# Altium schematic sheet BOC_Boot.SchDoc: Board-On-Chip Bootup Circuits
size B; Organization: Altium Limited; Address1: L3, 12a Rodborough Rd; Address2: Frenchs Forest; Address3: NSW; Address4: Australia 2086; Revision: 1.06; SheetNumber: 2; SheetTotal: 16
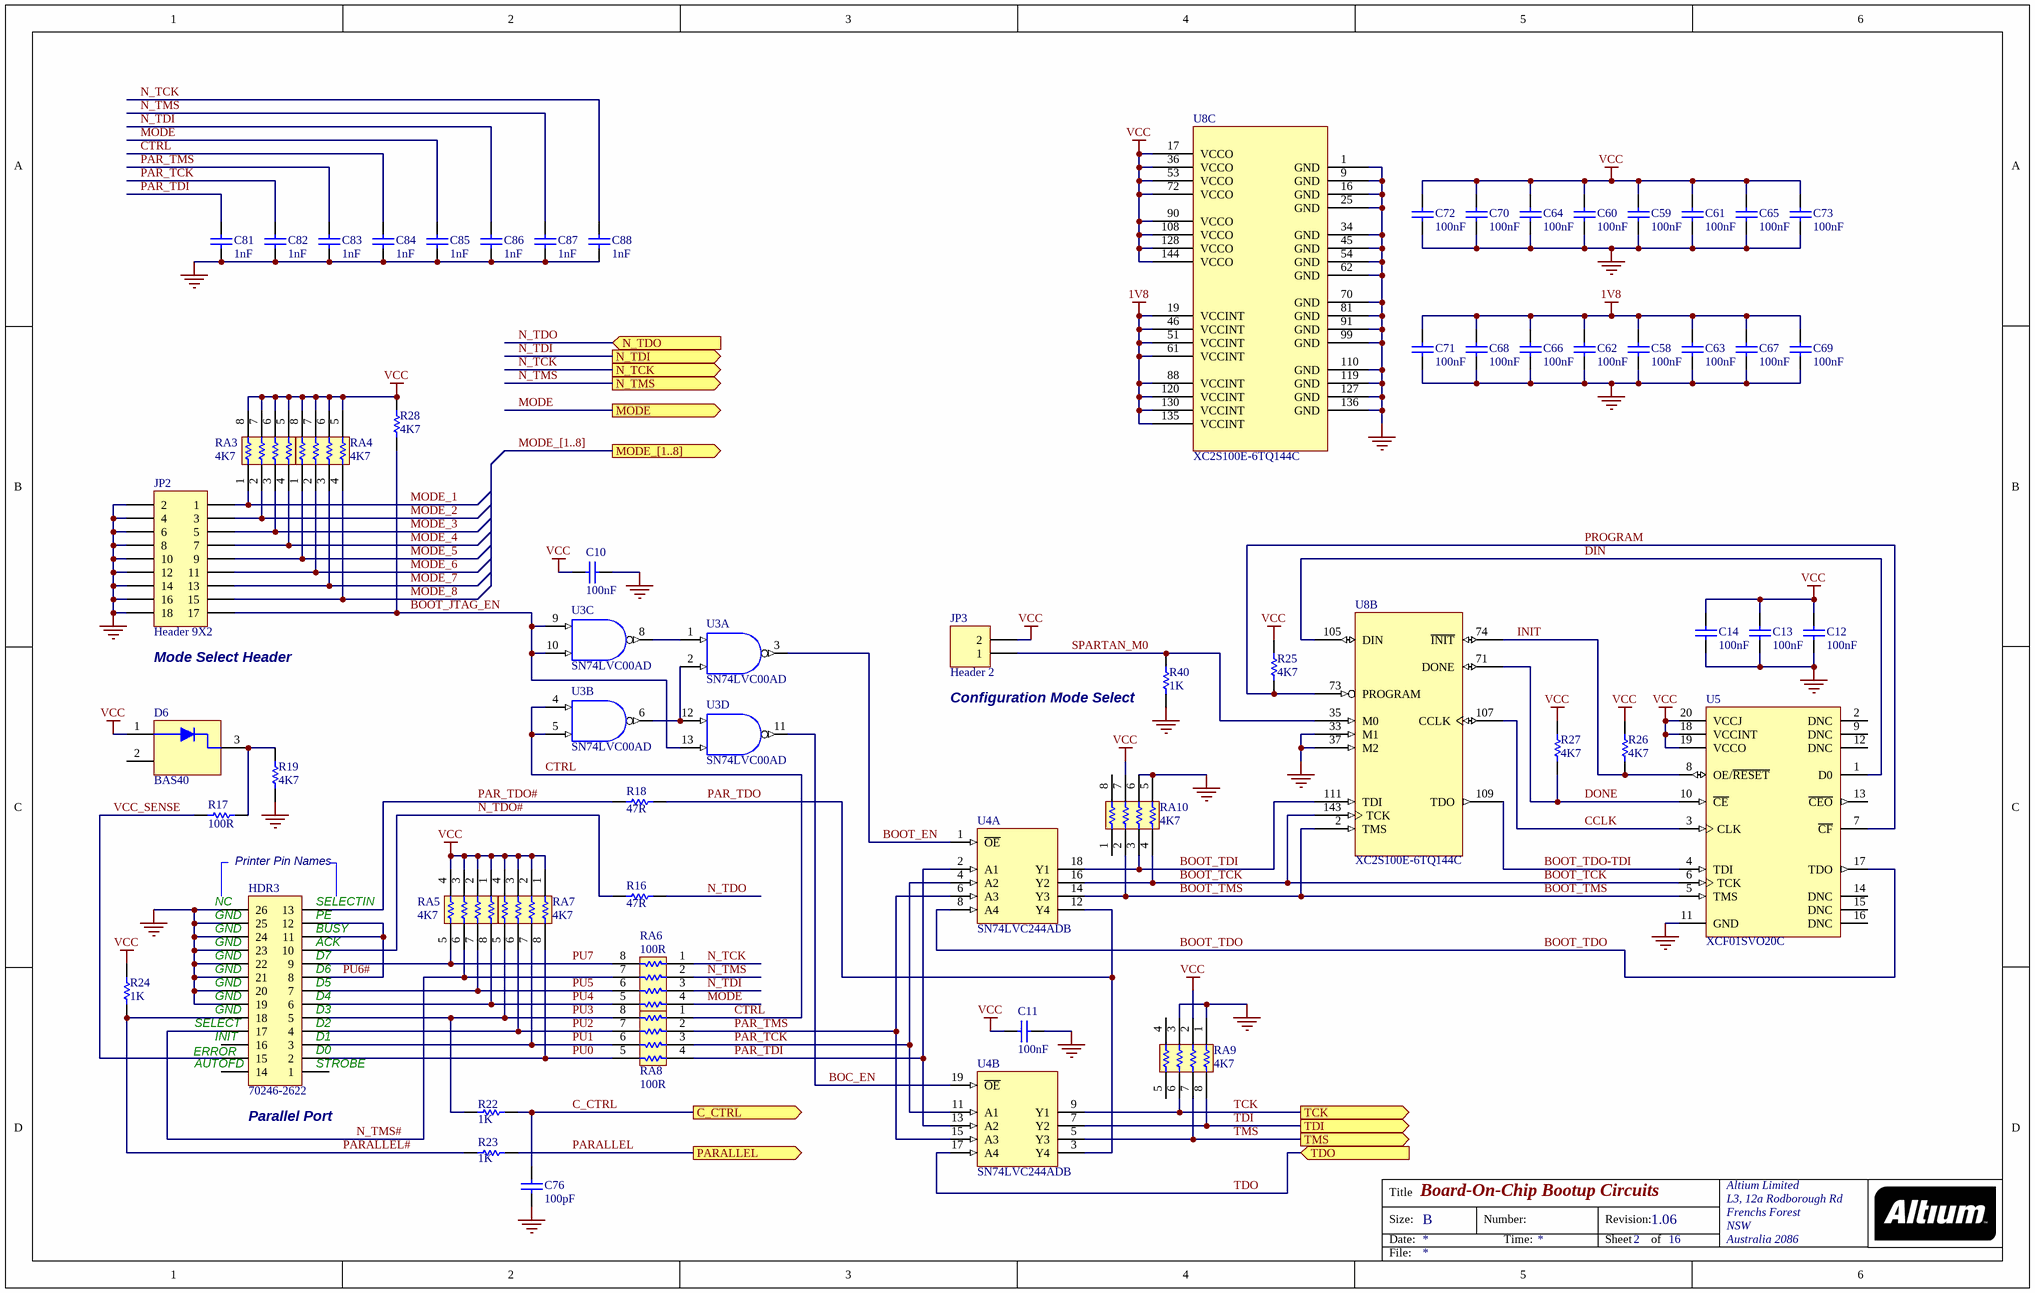
[diagram p0: BOC_Boot.SchDoc]

## Parts
C10  100nF  [CC2012-0805]
C11  100nF  [CC2012-0805]
C12  100nF  [CC2012-0805]
C13  100nF  [CC2012-0805]
C14  100nF  [CC2012-0805]
C58  100nF  [CC2012-0805]
C59  100nF  [CC2012-0805]
C60  100nF  [CC2012-0805]
C61  100nF  [CC2012-0805]
C62  100nF  [CC2012-0805]
C63  100nF  [CC2012-0805]
C64  100nF  [CC2012-0805]
C65  100nF  [CC2012-0805]
C66  100nF  [CC2012-0805]
C67  100nF  [CC2012-0805]
C68  100nF  [CC2012-0805]
C69  100nF  [CC2012-0805]
C70  100nF  [CC2012-0805]
C71  100nF  [CC2012-0805]
C72  100nF  [CC2012-0805]
C73  100nF  [CC2012-0805]
C76  100pF  [CC2012-0805]
C81  1nF  [CC2012-0805]
C82  1nF  [CC2012-0805]
C83  1nF  [CC2012-0805]
C84  1nF  [CC2012-0805]
C85  1nF  [CC2012-0805]
C86  1nF  [CC2012-0805]
C87  1nF  [CC2012-0805]
C88  1nF  [CC2012-0805]
D6  BAS40  [SO-G3]
HDR3  70246-2622  Usage: Parallel Port  [HDR2X13_CEN_LP]
JP2  Header 9X2  Usage: Mode Select Header  [HDR2X9]
JP3  Header 2  Usage: Configuration Mode Select  [HDR1X2]
R16  47R  [CC2012-0805]
R17  100R  [CC2012-0805]
R18  47R  [CC2012-0805]
R19  4K7  [CC2012-0805]
R22  1K  [CC2012-0805]
R23  1K  [CC2012-0805]
R24  1K  [CC2012-0805]
R25  4K7  [CC2012-0805]
R26  4K7  [CC2012-0805]
R27  4K7  [CC2012-0805]
R28  4K7  [CC2012-0805]
R40  1K  [CC2012-0805]
RA3  4K7  [MNR34]
RA4  4K7  [MNR34]
RA5  4K7  [MNR34]
RA6  100R  [MNR34]
RA7  4K7  [MNR34]
RA8  100R  [MNR34]
RA9  4K7  [MNR34]
RA10  4K7  [MNR34]
U3  SN74LVC00AD  [SO-G14/Y2.2]  (parts A,B,C,D of 4)
U4  SN74LVC244ADB  [SSO-G20/P.65]  (parts A,B of 2)
U5  XCF01SVO20C  [VO20]
U8  XC2S100E-6TQ144C  [TQ144]  (parts B,C of 3)

## Ports
C_CTRL (out), MODE (out), MODE_[1..8] (out), N_TCK (out), N_TDI (out), N_TDO (in), N_TMS (out), PARALLEL (out), TCK (out), TDI (out), TDO (in), TMS (out)

## Nets
1V8: C58.1 C62.1 C63.1 C66.1 C67.1 C68.1 C69.1 C71.1 U8.19(VCCINT) U8.46(VCCINT) U8.51(VCCINT) U8.61(VCCINT) U8.88(VCCINT) U8.120(VCCINT) U8.130(VCCINT) U8.135(VCCINT)
GND: C10.2 C11.2 C12.1 C13.1 C14.1 C58.2 C59.2 C60.2 C61.2 C62.2 C63.2 C64.2 C65.2 C66.2 C67.2 C68.2 C69.2 C70.2 C71.2 C72.2 C73.2 C76.2 C81.2 C82.2 C83.2 C84.2 C85.2 C86.2 C87.2 C88.2 HDR3.19 HDR3.20 HDR3.21 HDR3.22 HDR3.23 HDR3.24 HDR3.25 HDR3.26 JP2.2 JP2.4 JP2.6 JP2.8 JP2.10 JP2.12 JP2.14 JP2.16 JP2.18 R19.2 R40.1 RA9.1 RA9.3 RA10.5 RA10.6 U3.7(GND) U4.10(GND) U5.11(GND) U8.1(GND) U8.9(GND) U8.16(GND) U8.25(GND) U8.33(M1) U8.34(GND) U8.37(M2) U8.45(GND) U8.54(GND) U8.62(GND) U8.70(GND) U8.81(GND) U8.91(GND) U8.99(GND) U8.110(GND) U8.119(GND) U8.127(GND) U8.136(GND)
VCC: C10.1 C11.1 C12.2 C13.2 C14.2 C59.1 C60.1 C61.1 C64.1 C65.1 C70.1 C72.1 C73.1 D6.1 JP3.2 R24.2 R25.1 R26.1 R27.1 R28.2 RA3.5 RA3.6 RA3.7 RA3.8 RA4.5 RA4.6 RA4.7 RA4.8 RA5.1 RA5.2 RA5.3 RA5.4 RA7.1 RA7.2 RA7.3 RA7.4 RA9.2 RA10.7 U3.14(VDD) U4.20(VCC) U5.18(VCCINT) U5.19(VCCO) U5.20(VCCJ) U8.17(VCCO) U8.36(VCCO) U8.53(VCCO) U8.72(VCCO) U8.90(VCCO) U8.108(VCCO) U8.128(VCCO) U8.144(VCCO)
BOC_EN: U3.11(Y) U4.19(~{OE})
BOOT_EN: U3.3(Y) U4.1(~{OE})
BOOT_JTAG_EN: JP2.17 R28.1 U3.9(A) U3.10(B) U3.13(B)
BOOT_TCK: RA10.4 U4.16(Y2) U5.6(TCK) U8.143(TCK)
BOOT_TDI: RA10.3 U4.18(Y1) U8.111(TDI)
BOOT_TDO: U4.8(A4) U5.17(TDO)
BOOT_TDO-TDI: U5.4(TDI) U8.109(TDO)
BOOT_TMS: RA10.2 U4.14(Y3) U5.5(TMS) U8.2(TMS)
C_CTRL: C76.1 R22.2 ; port C_CTRL
CCLK: U5.3(CLK) U8.107(CCLK)
CTRL: C84.1 RA8.1 U3.4(A) U3.5(B)
DIN: U5.1(D0) U8.105(DIN)
DONE: R27.2 U5.10(~{CE}) U8.71(DONE)
INIT: R26.2 U5.8(OE/~{RESET}) U8.74(~{INIT})
MODE: C85.1 RA6.4 ; port MODE
MODE_1: JP2.1 RA3.1
MODE_2: JP2.3 RA3.2
MODE_3: JP2.5 RA3.3
MODE_4: JP2.7 RA3.4
MODE_5: JP2.9 RA4.1
MODE_6: JP2.11 RA4.2
MODE_7: JP2.13 RA4.3
MODE_8: JP2.15 RA4.4
N_TCK: C88.1 RA6.1 ; port N_TCK
N_TDI: C86.1 RA6.3 ; port N_TDI
N_TDO: R16.2 ; port N_TDO
N_TDO#: HDR3.10 R16.1
N_TMS: C87.1 RA6.2 ; port N_TMS
N_TMS#: HDR3.17 RA5.6 RA6.7
PAR_TCK: C82.1 RA8.3 U4.4(A2) U4.11(A1)
PAR_TDI: C81.1 RA8.4 U4.2(A1) U4.13(A2)
PAR_TDO: R18.2 U4.3(Y4) U4.12(Y4)
PAR_TDO#: HDR3.13 R18.1
PAR_TMS: C83.1 RA8.2 U4.6(A3) U4.15(A3)
PARALLEL: R23.2 ; port PARALLEL
PARALLEL#: HDR3.18 R23.1 R24.1
PROGRAM: R25.2 U5.7(~{CF}) U8.73(PROGRAM)
PU0: HDR3.2 RA7.8 RA8.5
PU1: HDR3.3 RA7.7 RA8.6
PU2: HDR3.4 RA7.6 RA8.7
PU3: HDR3.5 R22.1 RA7.5 RA8.8
PU4: HDR3.6 RA5.8 RA6.5
PU5: HDR3.7 RA5.7 RA6.6
PU6#: HDR3.8 HDR3.11 HDR3.12
PU7: HDR3.9 RA5.5 RA6.8
SPARTAN_M0: JP3.1 R40.2 U8.35(M0)
TCK: RA9.6 U4.9(Y1) ; port TCK
TDI: RA9.8 U4.7(Y2) ; port TDI
TDO: U4.17(A4) ; port TDO
TMS: RA9.7 U4.5(Y3) ; port TMS
VCC_SENSE: HDR3.15 R17.1
NetD6_3: D6.3 R17.2 R19.1
NetU3_1: U3.1(A) U3.8(Y)
NetU3_2: U3.2(B) U3.6(Y) U3.12(A)

Not connected (* = marked no-connect by the designer): D6 2; HDR3 1 14 16; RA9 4 5; RA10 1 8; U5 2(DNC) 9(DNC) 12(DNC) 13(~{CEO}) 14(DNC) 15(DNC) 16(DNC)

## Buses and harness runs
bus MODE_[1..8] = port MODE_[1..8]

## Notes on the sheet
- (near HDR3) NC
- Printer Pin Names
- (near HDR3) SELECTIN
- (near HDR3) GND
- (near HDR3) PE
- (near HDR3) BUSY
- (near HDR3) ACK
- (near HDR3) D6
- (near HDR3) D7
- (near HDR3) SELECT
- (near HDR3) INIT
- (near HDR3) D1
- (near HDR3) D2
- (near HDR3) D3
- (near HDR3) D4
- (near HDR3) D5
- (near HDR3) ERROR
- (near HDR3) AUTOFD
- (near HDR3) STROBE
- (near HDR3) D0
- Title
- Size:
- Date:
- B
- Number:
- Time:
- Revision:
- Sheet
- of
- File:

## Library data of the parts
C10-C14 C58-C73 C76 C81-C88 = CAP: Capacitor; Fitted: True
D6 = BAS40: Shottky Diode; Fitted: True
HDR3 = Header 13X2A: Header, 13-Pin, Dual row; Manufacturer: Generic Components; Class I: Connector; Fitted: True; Revision: July-2002: Re-released for DXP Platform.; Publisher: Altium Limited
JP2 = Header 9X2: Header, 9-Pin, Dual row; Manufacturer: Generic Components; Class I: Connector; Fitted: True; Revision: July-2002: Re-released for DXP Platform.; Publisher: Altium Limited
JP3 = Header 2: Header, 2-Pin; Manufacturer: Generic Components; Class I: Connector; Fitted: True; Revision: July-2002: Re-released for DXP Platform.; Publisher: Altium Limited
R16-R19 R22-R28 R40 = RES: Resistor; Fitted: True
RA3-RA10 = MNR34: 3216x4 Resistor Array; Fitted: True
U3 = MC74HC00AD: Quad 2-Input NAND Gate; Manufacturer: Motorola; Package Information: Latest Revision: 1991; Class I: Logic; Fitted: True; Published: 15-Apr-2002; Datasheet: High-Speed CMOS Logic Data, DL129 Rev4 (1989); Package Reference: 751A-02; Publisher: Altium Limited; Class II: Gate
U4 = 74LVC244A: Octal Buffer/Driver with 3-State Outputs; Manufacturer: Philips; Package Information: Latest Revision: 1998; Class I: Logic; Class II: Buffer/Line Driver; Fitted: True; Published: 8-Jun-2000; Revision: July-2002: Re-released for DXP Platform.; Datasheet: Latest Revision: Jul-1998; Package Reference: SSOP20; Publisher: Altium Limited
U5 = XCF01SVO20C: XCF00S Series, Platform Flash In-System Programmable Configuration 3.3V PROM, 1-Megabit, Commercial Grade; Manufacturer: Xilinx; Package Information: Latest Revision: ver1.0, May-2003; Class I: Memory; Code - JEDEC: MO-153-AC; Fitted: True; Published: 20-Aug-2003; Datasheet: Latest Revision: ver1.1, June-2003; Package Reference: VO20; Publisher: Altium Limited; Class II: PROM
U8 = XC2S100E-6TQ144C: Spartan-IIE 1.8V FPGA, 144-Pin TQFP, Standard Performance, Commercial Grade; Manufacturer: Xilinx; Package Information: Latest Revision: ver1.1, Oct-2002; Class I: Field Programmable Gate Array; Code - JEDEC: MS-026-BFB; Code - IPC: SQFP20X20-144; Fitted: True; Published: 19-Jul-2002; Revision: 25-Aug-2003; Datasheet: Latest Revision: 14-Feb-2003; Package Reference: TQ144; Publisher: Altium Limited; Class II: Spartan-IIE